# Altium project RFR24 AMS Design V1.PrjPcb (part 1 of 2)
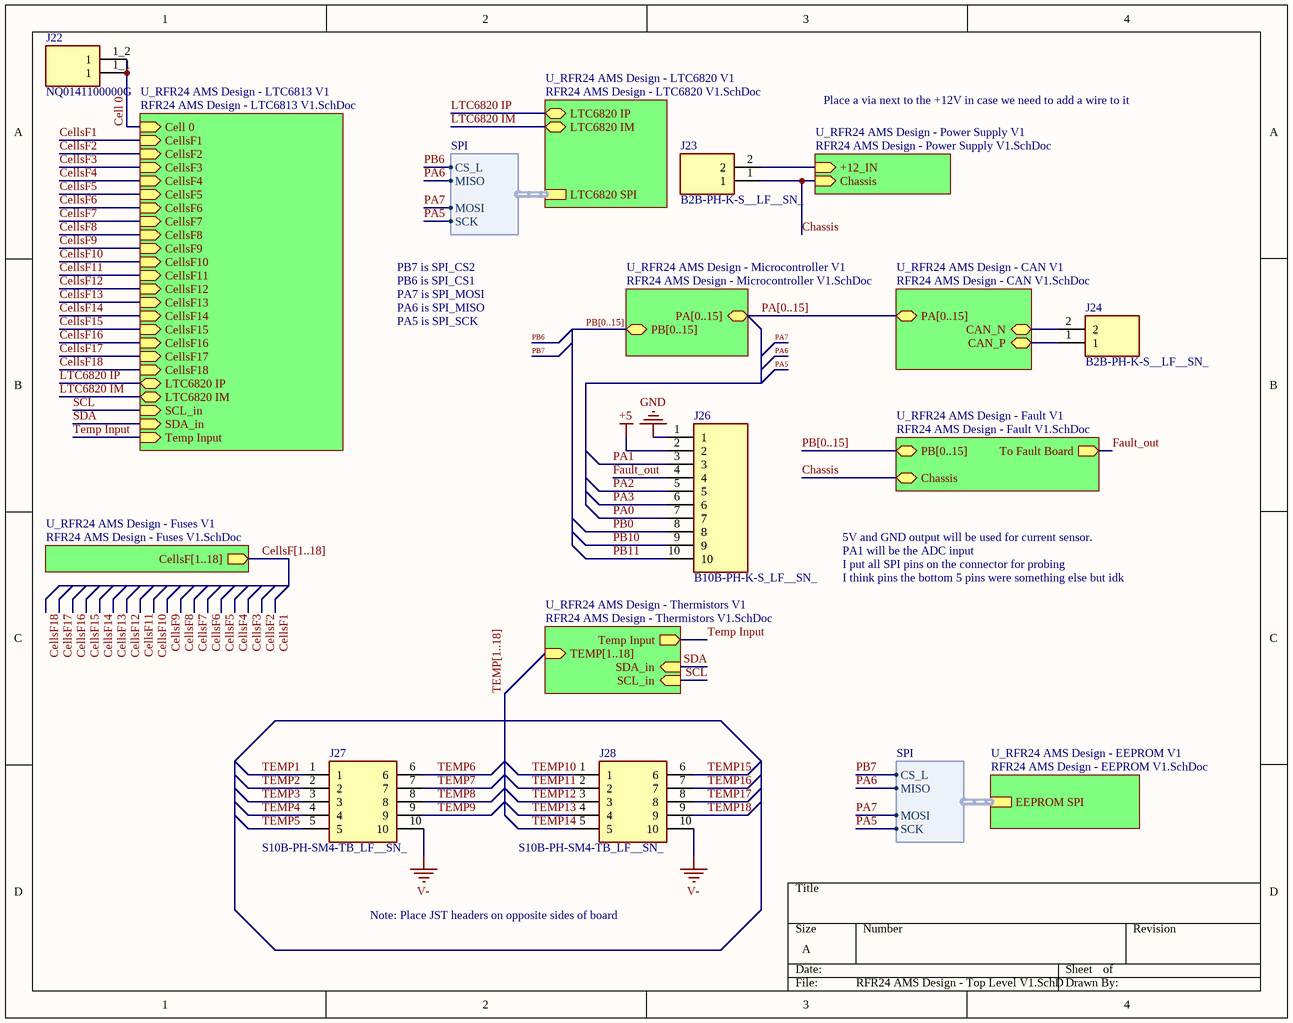
[diagram p0: RFR24 AMS Design - Top Level V1.SchDoc]
10 sheets, 294 parts. Net scope: hierarchical (ports join the sheet entries above them; power ports are global).
Board files: RFR24 AMS Design - PCB V1.PcbDoc, RFR24 AMS Design - PCB V2.PcbDoc, RFR24 AMS Design - MCU Stackup PCB V1.PcbDoc, RFR24 AMS Design - PCB V3.PcbDoc
Sheets:
  RFR24 AMS Design - Top Level V1.SchDoc
    U_RFR24 AMS Design - LTC6813 V1 = RFR24 AMS Design - LTC6813 V1.SchDoc
    U_RFR24 AMS Design - LTC6820 V1 = RFR24 AMS Design - LTC6820 V1.SchDoc
    U_RFR24 AMS Design - Microcontroller V1 = RFR24 AMS Design - Microcontroller V1.SchDoc
    U_RFR24 AMS Design - Power Supply V1 = RFR24 AMS Design - Power Supply V1.SchDoc
    U_RFR24 AMS Design - CAN V1 = RFR24 AMS Design - CAN V1.SchDoc
    U_RFR24 AMS Design - EEPROM V1 = RFR24 AMS Design - EEPROM V1.SchDoc
    U_RFR24 AMS Design - Thermistors V1 = RFR24 AMS Design - Thermistors V1.SchDoc
    U_RFR24 AMS Design - Fuses V1 = RFR24 AMS Design - Fuses V1.SchDoc
    U_RFR24 AMS Design - Fault V1 = RFR24 AMS Design - Fault V1.SchDoc

## Sheet RFR24 AMS Design - Top Level V1.SchDoc
size A; SheetNumber: 1; SheetTotal: 10

### Parts
J22  NQ0141100000G  [AMPHENOL_NQ0141100000G]
J23  B2B-PH-K-S__LF__SN_  [B2BPHKSLFSN]
J24  B2B-PH-K-S__LF__SN_  [B2BPHKSLFSN]
J26  B10B-PH-K-S_LF__SN_  [SHDR10W50P0X200_1X10_2190X450X600P]
J27  S10B-PH-SM4-TB_LF__SN_  [S10B-PH-SM4-TB]
J28  S10B-PH-SM4-TB_LF__SN_  [S10B-PH-SM4-TB]

### Sub-sheets
U_RFR24 AMS Design - CAN V1 = RFR24 AMS Design - CAN V1.SchDoc: PA[0..15] (bidir), CAN_N (bidir), CAN_P (bidir)
U_RFR24 AMS Design - EEPROM V1 = RFR24 AMS Design - EEPROM V1.SchDoc: EEPROM SPI (harness SPI)
U_RFR24 AMS Design - Fault V1 = RFR24 AMS Design - Fault V1.SchDoc: To Fault Board (out), Chassis (bidir), PB[0..15] (bidir)
U_RFR24 AMS Design - Fuses V1 = RFR24 AMS Design - Fuses V1.SchDoc: CellsF[1..18] (out)
U_RFR24 AMS Design - LTC6813 V1 = RFR24 AMS Design - LTC6813 V1.SchDoc: LTC6820 IP (bidir), LTC6820 IM (bidir), SCL_in (in), SDA_in (in), Cell 0 (in), CellsF1 (in), CellsF2 (in), CellsF3 (in), CellsF4 (in), CellsF5 (in), CellsF6 (in), CellsF7 (in), CellsF8 (in), CellsF9 (in), CellsF10 (in), CellsF11 (in), CellsF12 (in), CellsF13 (in), CellsF14 (in), CellsF15 (in), CellsF16 (in), CellsF17 (in), CellsF18 (in), Temp Input (in)
U_RFR24 AMS Design - LTC6820 V1 = RFR24 AMS Design - LTC6820 V1.SchDoc: LTC6820 IP (bidir), LTC6820 IM (bidir), LTC6820 SPI (harness SPI)
U_RFR24 AMS Design - Microcontroller V1 = RFR24 AMS Design - Microcontroller V1.SchDoc: PA[0..15] (bidir), PB[0..15] (bidir)
U_RFR24 AMS Design - Power Supply V1 = RFR24 AMS Design - Power Supply V1.SchDoc: +12_IN (in), Chassis (in)
U_RFR24 AMS Design - Thermistors V1 = RFR24 AMS Design - Thermistors V1.SchDoc: SDA_in (in), SCL_in (in), TEMP[1..18] (in), Temp Input (out)

### Harnesses
SPI: CS_L, MISO, MOSI, SCK

### Nets
+5: J26.2
GND: J26.1
V-: J27.10 J28.10
CAN_N: J24.2 ; sheet U_RFR24 AMS Design - CAN V1/CAN_N
CAN_P: J24.1 ; sheet U_RFR24 AMS Design - CAN V1/CAN_P
Cell 0: J22.1_1(1) J22.1_2(1) ; sheet U_RFR24 AMS Design - LTC6813 V1/Cell 0
Chassis: J23.1 ; sheet U_RFR24 AMS Design - Power Supply V1/Chassis, sheet U_RFR24 AMS Design - Fault V1/Chassis
Fault_out: J26.4 ; sheet U_RFR24 AMS Design - Fault V1/To Fault Board
LTC6820 IM: sheet U_RFR24 AMS Design - LTC6813 V1/LTC6820 IM, sheet U_RFR24 AMS Design - LTC6820 V1/LTC6820 IM
LTC6820 IP: sheet U_RFR24 AMS Design - LTC6813 V1/LTC6820 IP, sheet U_RFR24 AMS Design - LTC6820 V1/LTC6820 IP
PA0: J26.7
PA1: J26.3
PA2: J26.5
PA3: J26.6
PA5: sheet U_RFR24 AMS Design - LTC6820 V1/LTC6820 SPI.SCK, sheet U_RFR24 AMS Design - EEPROM V1/EEPROM SPI.SCK
PA6: sheet U_RFR24 AMS Design - LTC6820 V1/LTC6820 SPI.MISO, sheet U_RFR24 AMS Design - EEPROM V1/EEPROM SPI.MISO  [project net MISO]
PA7: sheet U_RFR24 AMS Design - LTC6820 V1/LTC6820 SPI.MOSI, sheet U_RFR24 AMS Design - EEPROM V1/EEPROM SPI.MOSI  [project net MOSI]
PB0: J26.8
PB10: J26.9
PB11: J26.10
SCL: sheet U_RFR24 AMS Design - LTC6813 V1/SCL_in, sheet U_RFR24 AMS Design - Thermistors V1/SCL_in
SDA: sheet U_RFR24 AMS Design - LTC6813 V1/SDA_in, sheet U_RFR24 AMS Design - Thermistors V1/SDA_in
TEMP1: J27.1
TEMP2: J27.2
TEMP3: J27.3
TEMP4: J27.4
TEMP5: J27.5
TEMP6: J27.6
TEMP7: J27.7
TEMP8: J27.8
TEMP9: J27.9
TEMP10: J28.1
TEMP11: J28.2
TEMP12: J28.3
TEMP13: J28.4
TEMP14: J28.5
TEMP15: J28.6
TEMP16: J28.7
TEMP17: J28.8
TEMP18: J28.9
Temp Input: sheet U_RFR24 AMS Design - LTC6813 V1/Temp Input, sheet U_RFR24 AMS Design - Thermistors V1/Temp Input
NetF19_1: J23.2 ; sheet U_RFR24 AMS Design - Power Supply V1/+12_IN

### Buses and harness runs
bus CellsF[1..18] = sheet U_RFR24 AMS Design - Fuses V1/CellsF[1..18]
bus PA[0..15] = sheet U_RFR24 AMS Design - CAN V1/PA[0..15] = sheet U_RFR24 AMS Design - Microcontroller V1/PA[0..15]
bus PB[0..15] = sheet U_RFR24 AMS Design - Fault V1/PB[0..15]
bus PB[0..15] = sheet U_RFR24 AMS Design - Microcontroller V1/PB[0..15]
bus TEMP[1..18] = sheet U_RFR24 AMS Design - Thermistors V1/TEMP[1..18]

### Notes on the sheet
- Place a via next to the +12V in case we need to add a wire to it
- PA7 is SPI_MOSI
- PB6 is SPI_CS1
- PB7 is SPI_CS2
- PA5 is SPI_SCK
- PA6 is SPI_MISO
- 5V and GND output will be used for current sensor.
- PA1 will be the ADC input
- I put all SPI pins on the connector for probing
- I think pins the bottom 5 pins were something else but idk
- Note: Place JST headers on opposite sides of board

### Library data of the parts
J22 = NQ0141100000G: 1 Position Wire to Board Terminal Block Horizontal with Board Surface Mount; MF: Amphenol Anytek; Package: None; Check_prices: https://www.snapeda.com/parts/NQ0141100000G/Amphenol/view-part/?ref=eda; Availability: In Stock; Value: *; MP: NQ0141100000G; SnapEDA_Link: https://www.snapeda.com/parts/NQ0141100000G/Amphenol/view-part/?ref=snap; Price: None; Purchase-URL: https://pricing.snapeda.com/search/part/NQ0141100000G/?ref=eda
J23 J24 = B2B-PH-K-S__LF__SN_: Circulator or Directional Coupler; Manufacturer_Name: JST (JAPAN SOLDERLESS TERMINALS); Manufacturer_Part_Number: B2B-PH-K-S (LF)(SN); Datasheet Link: http://www.jst-mfg.com/product/pdf/eng/ePH.pdf; Height: 6mm
J26 = B10B-PH-K-S_LF__SN_: Connector; Manufacturer_Name: JST (JAPAN SOLDERLESS TERMINALS); Manufacturer_Part_Number: B10B-PH-K-S(LF)(SN); Datasheet Link: http://uk.rs-online.com/web/p/products/8201428; Height: 6mm; Arrow Part Number: B10B-PH-K-S(LF)(SN); Arrow Price/Stock: https://www.arrow.com/en/products/b10b-ph-k-s-lf-sn/jst-manufacturing?region=europe
J27 J28 = S10B-PH-SM4-TB_LF__SN_: Connector; Manufacturer_Name: JST (JAPAN SOLDERLESS TERMINALS); Manufacturer_Part_Number: S10B-PH-SM4-TB(LF)(SN); Datasheet Link: http://uk.rs-online.com/web/p/products/6881350; Arrow Part Number: S10B-PH-SM4-TB(LF)(SN); Arrow Price/Stock: https://www.arrow.com/en/products/s10b-ph-sm4-tb-lf-sn/jst-manufacturing?region=nac

## Sheet RFR24 AMS Design - LTC6813 V1.SchDoc
size 279 x 457 mm; SheetNumber: 2; SheetTotal: 10
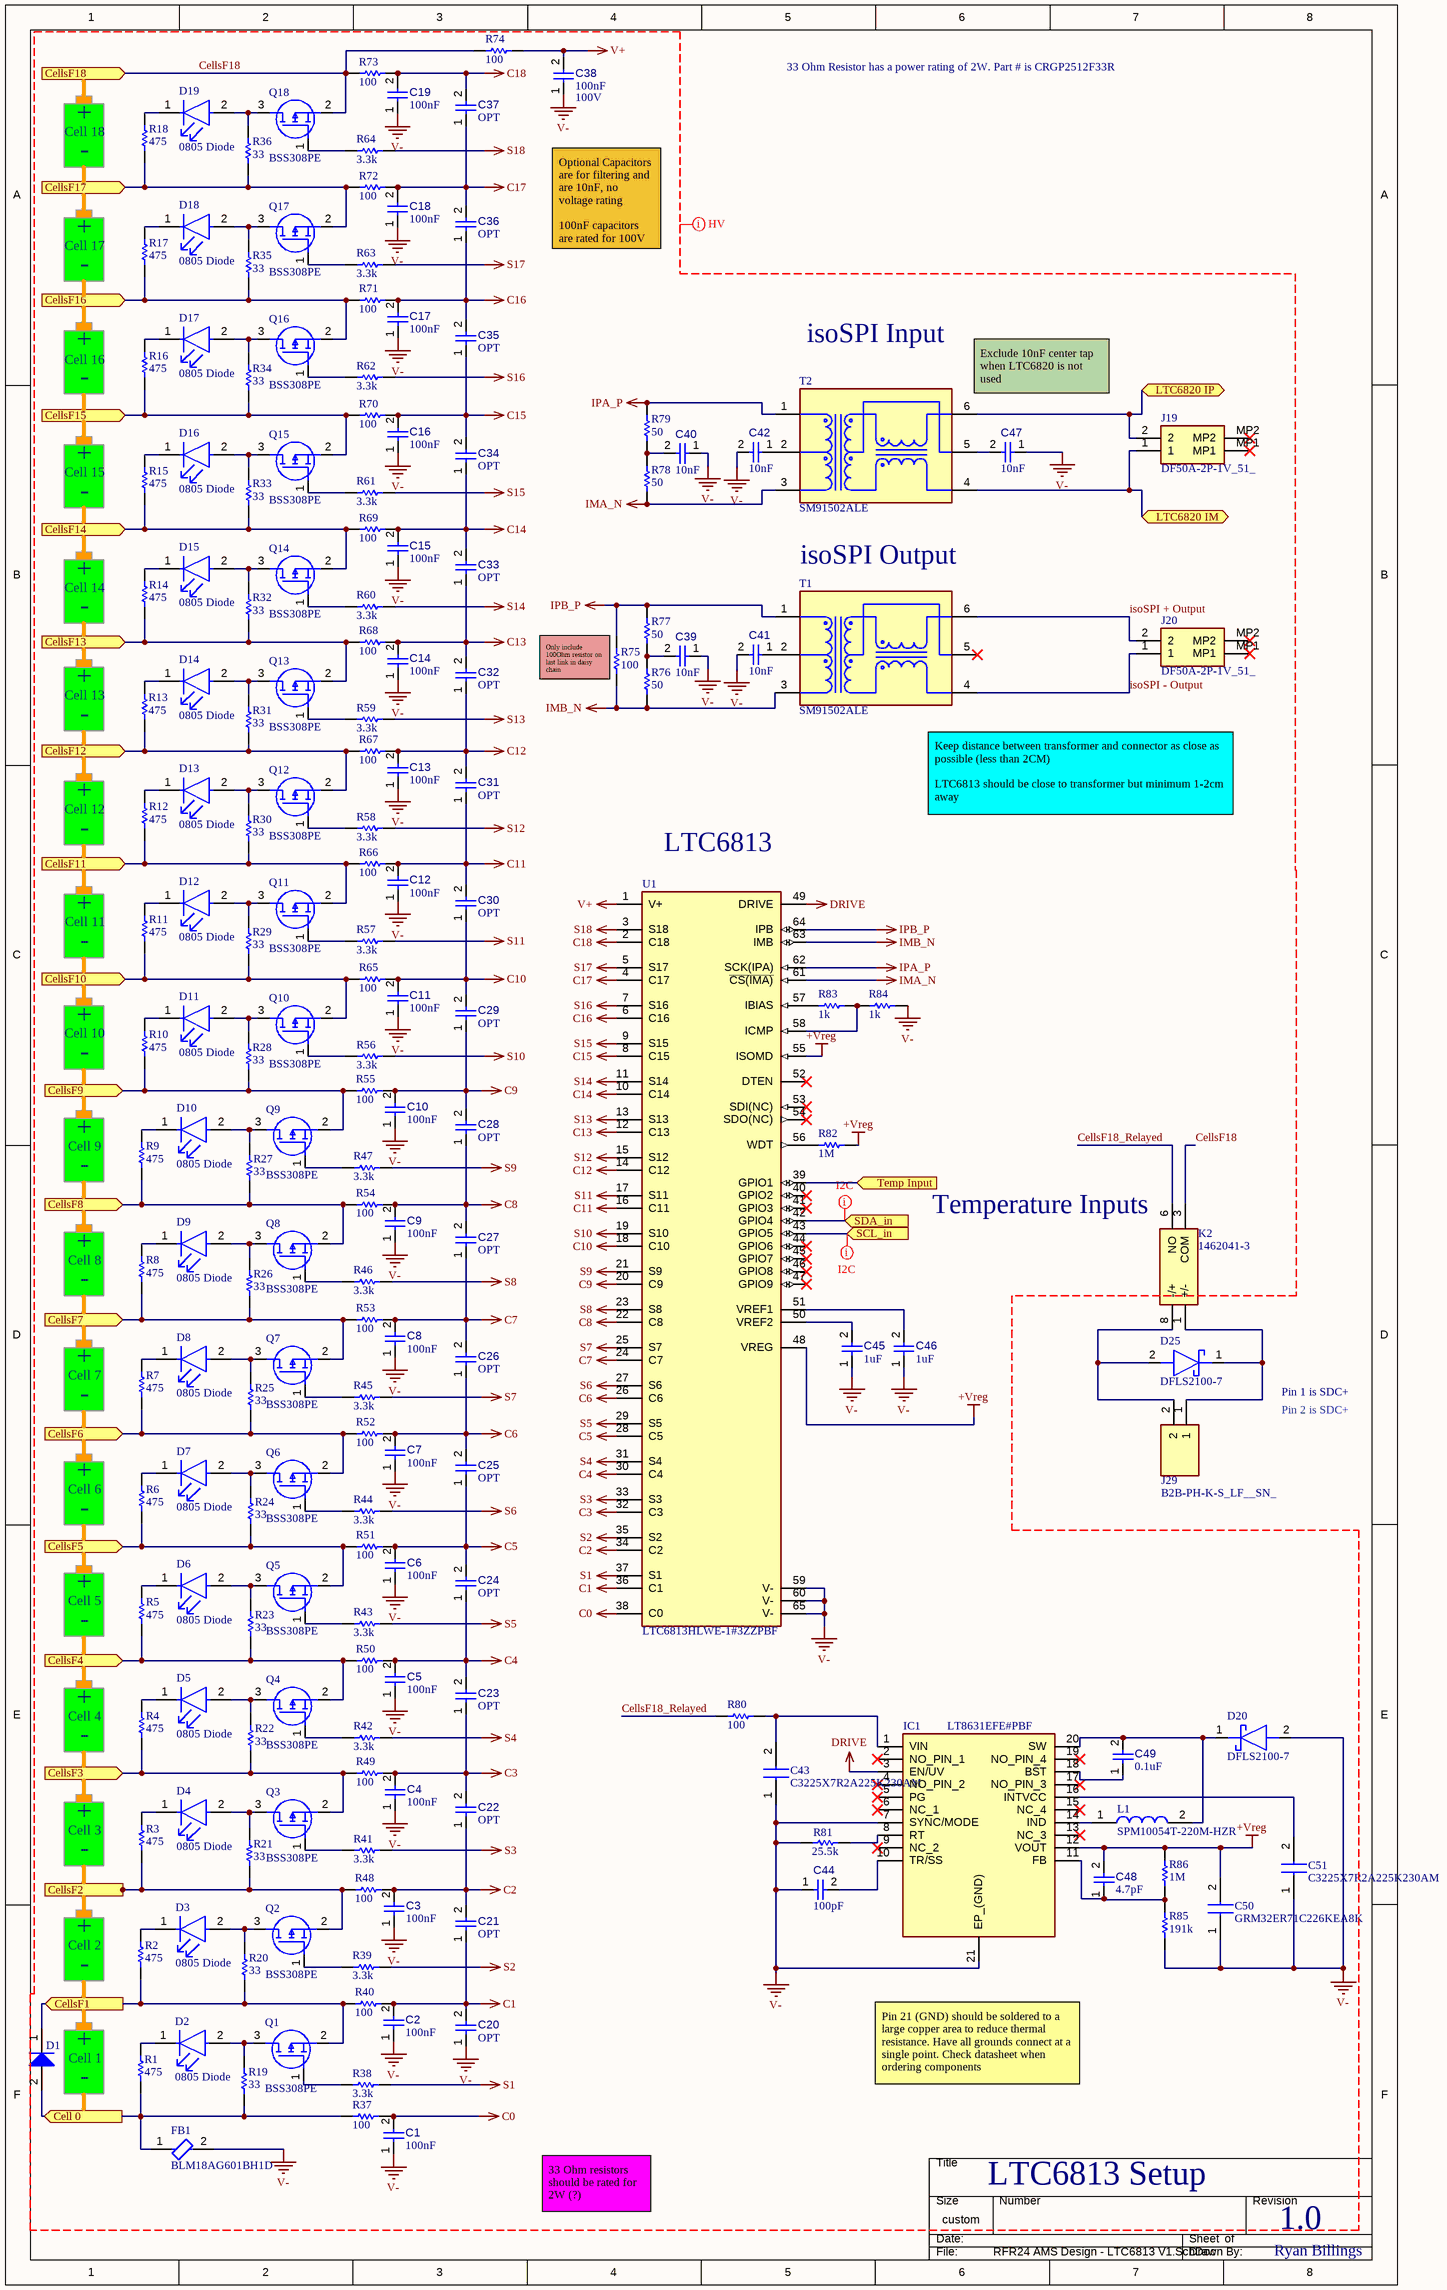
[diagram p1: RFR24 AMS Design - LTC6813 V1.SchDoc]

### Parts
C1  value 100nF  [CAPC2013X145X50ML20T25]  (hidden comment: Capacitor 1 uF +/- 10% 25 V 0805)
C2  value 100nF  [CAPC2013X145X50ML20T25]  (hidden comment: Capacitor 1 uF +/- 10% 25 V 0805)
C3  value 100nF  [CAPC2013X145X50ML20T25]  (hidden comment: Capacitor 1 uF +/- 10% 25 V 0805)
C4  value 100nF  [CAPC2013X145X50ML20T25]  (hidden comment: Capacitor 1 uF +/- 10% 25 V 0805)
C5  value 100nF  [CAPC2013X145X50ML20T25]  (hidden comment: Capacitor 1 uF +/- 10% 25 V 0805)
C6  value 100nF  [CAPC2013X145X50ML20T25]  (hidden comment: Capacitor 1 uF +/- 10% 25 V 0805)
C7  value 100nF  [CAPC2013X145X50ML20T25]  (hidden comment: Capacitor 1 uF +/- 10% 25 V 0805)
C8  value 100nF  [CAPC2013X145X50ML20T25]  (hidden comment: Capacitor 1 uF +/- 10% 25 V 0805)
C9  value 100nF  [CAPC2013X145X50ML20T25]  (hidden comment: Capacitor 1 uF +/- 10% 25 V 0805)
C10  value 100nF  [CAPC2013X145X50ML20T25]  (hidden comment: Capacitor 1 uF +/- 10% 25 V 0805)
C11  value 100nF  [CAPC2013X145X50ML20T25]  (hidden comment: Capacitor 1 uF +/- 10% 25 V 0805)
C12  value 100nF  [CAPC2013X145X50ML20T25]  (hidden comment: Capacitor 1 uF +/- 10% 25 V 0805)
C13  value 100nF  [CAPC2013X145X50ML20T25]  (hidden comment: Capacitor 1 uF +/- 10% 25 V 0805)
C14  value 100nF  [CAPC2013X145X50ML20T25]  (hidden comment: Capacitor 1 uF +/- 10% 25 V 0805)
C15  value 100nF  [CAPC2013X145X50ML20T25]  (hidden comment: Capacitor 1 uF +/- 10% 25 V 0805)
C16  value 100nF  [CAPC2013X145X50ML20T25]  (hidden comment: Capacitor 1 uF +/- 10% 25 V 0805)
C17  value 100nF  [CAPC2013X145X50ML20T25]  (hidden comment: Capacitor 1 uF +/- 10% 25 V 0805)
C18  value 100nF  [CAPC2013X145X50ML20T25]  (hidden comment: Capacitor 1 uF +/- 10% 25 V 0805)
C19  value 100nF  [CAPC2013X145X50ML20T25]  (hidden comment: Capacitor 1 uF +/- 10% 25 V 0805)
C20  value OPT  [CAPC2013X145X50ML20T25]  (hidden comment: Capacitor 1 uF +/- 10% 25 V 0805)
C21  value OPT  [CAPC2013X145X50ML20T25]  (hidden comment: Capacitor 1 uF +/- 10% 25 V 0805)
C22  value OPT  [CAPC2013X145X50ML20T25]  (hidden comment: Capacitor 1 uF +/- 10% 25 V 0805)
C23  value OPT  [CAPC2013X145X50ML20T25]  (hidden comment: Capacitor 1 uF +/- 10% 25 V 0805)
C24  value OPT  [CAPC2013X145X50ML20T25]  (hidden comment: Capacitor 1 uF +/- 10% 25 V 0805)
C25  value OPT  [CAPC2013X145X50ML20T25]  (hidden comment: Capacitor 1 uF +/- 10% 25 V 0805)
C26  value OPT  [CAPC2013X145X50ML20T25]  (hidden comment: Capacitor 1 uF +/- 10% 25 V 0805)
C27  value OPT  [CAPC2013X145X50ML20T25]  (hidden comment: Capacitor 1 uF +/- 10% 25 V 0805)
C28  value OPT  [CAPC2013X145X50ML20T25]  (hidden comment: Capacitor 1 uF +/- 10% 25 V 0805)
C29  value OPT  [CAPC2013X145X50ML20T25]  (hidden comment: Capacitor 1 uF +/- 10% 25 V 0805)
C30  value OPT  [CAPC2013X145X50ML20T25]  (hidden comment: Capacitor 1 uF +/- 10% 25 V 0805)
C31  value OPT  [CAPC2013X145X50ML20T25]  (hidden comment: Capacitor 1 uF +/- 10% 25 V 0805)
C32  value OPT  [CAPC2013X145X50ML20T25]  (hidden comment: Capacitor 1 uF +/- 10% 25 V 0805)
C33  value OPT  [CAPC2013X145X50ML20T25]  (hidden comment: Capacitor 1 uF +/- 10% 25 V 0805)
C34  value OPT  [CAPC2013X145X50ML20T25]  (hidden comment: Capacitor 1 uF +/- 10% 25 V 0805)
C35  value OPT  [CAPC2013X145X50ML20T25]  (hidden comment: Capacitor 1 uF +/- 10% 25 V 0805)
C36  value OPT  [CAPC2013X145X50ML20T25]  (hidden comment: Capacitor 1 uF +/- 10% 25 V 0805)
C37  value OPT  [CAPC2013X145X50ML20T25]  (hidden comment: Capacitor 1 uF +/- 10% 25 V 0805)
C38  value 100nF  Voltage Rating: 100V  [CAPC2013X145X50ML20T25]  (hidden comment: Capacitor 1 uF +/- 10% 25 V 0805)
C39  value 10nF  [CAPC2013X145X50LL20T25]  (hidden comment: Capacitor 1 uF +/- 10% 25 V 0805)
C40  value 10nF  [CAPC2013X145X50LL20T25]  (hidden comment: Capacitor 1 uF +/- 10% 25 V 0805)
C41  value 10nF  [CAPC2013X145X50LL20T25]  (hidden comment: Capacitor 1 uF +/- 10% 25 V 0805)
C42  value 10nF  [CAPC2013X145X50LL20T25]  (hidden comment: Capacitor 1 uF +/- 10% 25 V 0805)
C43  C3225X7R2A225K230AM  [CAPC3225X270N]
C44  value 100pF  [CAPC2013X145X50LL20T25]  (hidden comment: Capacitor 1 uF +/- 10% 25 V 0805)
C45  value 1uF  [CAPC2013X145X50LL20T25]  (hidden comment: Capacitor 1 uF +/- 10% 25 V 0805)
C46  value 1uF  [CAPC2013X145X50LL20T25]  (hidden comment: Capacitor 1 uF +/- 10% 25 V 0805)
C47  value 10nF  [CAPC2013X145X50LL20T25]  (hidden comment: Capacitor 1 uF +/- 10% 25 V 0805)
C48  value 4.7pF  [CAPC2013X145X50LL20T25]  (hidden comment: Capacitor 1 uF +/- 10% 25 V 0805)
C49  value 0.1uF  [CAPC2013X145X50LL20T25]  (hidden comment: Capacitor 1 uF +/- 10% 25 V 0805)
C50  GRM32ER71C226KEA8K  [CAPC3225X270N]
C51  C3225X7R2A225K230AM  [CAPC3225X270N]
D1  unknown  [INF-SOD323_V]  (value not drawn)
D2  0805 Diode  [FP-APHCM2012SYCK-F01-MFG]
D3  0805 Diode  [FP-APHCM2012SYCK-F01-MFG]
D4  0805 Diode  [FP-APHCM2012SYCK-F01-MFG]
D5  0805 Diode  [FP-APHCM2012SYCK-F01-MFG]
D6  0805 Diode  [FP-APHCM2012SYCK-F01-MFG]
D7  0805 Diode  [FP-APHCM2012SYCK-F01-MFG]
D8  0805 Diode  [FP-APHCM2012SYCK-F01-MFG]
D9  0805 Diode  [FP-APHCM2012SYCK-F01-MFG]
D10  0805 Diode  [FP-APHCM2012SYCK-F01-MFG]
D11  0805 Diode  [FP-APHCM2012SYCK-F01-MFG]
D12  0805 Diode  [FP-APHCM2012SYCK-F01-MFG]
D13  0805 Diode  [FP-APHCM2012SYCK-F01-MFG]
D14  0805 Diode  [FP-APHCM2012SYCK-F01-MFG]
D15  0805 Diode  [FP-APHCM2012SYCK-F01-MFG]
D16  0805 Diode  [FP-APHCM2012SYCK-F01-MFG]
D17  0805 Diode  [FP-APHCM2012SYCK-F01-MFG]
D18  0805 Diode  [FP-APHCM2012SYCK-F01-MFG]
D19  0805 Diode  [FP-APHCM2012SYCK-F01-MFG]
D20  DFLS2100-7  [POWERDI123_1]
D25  DFLS2100-7  [POWERDI123_1]
FB1  BLM18AG601BH1D  [FP-BLM18-0_15-t0_8-IPC_A]
IC1  LT8631EFE#PBF  [SOP65P640X120-21N]
J19  DF50A-2P-1V_51_  [DF50A2P1V51]
J20  DF50A-2P-1V_51_  [DF50A2P1V51]
J29  B2B-PH-K-S_LF__SN_  [SHDR2W50P0X200_1X2_590X450X600P]
K2  1462041-3  [14620417]
L1  SPM10054T-220M-HZR  [SPM10054T220MHZR]
Q1  BSS308PE  [SOT95P260X110-3N]
Q2  BSS308PE  [SOT95P260X110-3N]
Q3  BSS308PE  [SOT95P260X110-3N]
Q4  BSS308PE  [SOT95P260X110-3N]
Q5  BSS308PE  [SOT95P260X110-3N]
Q6  BSS308PE  [SOT95P260X110-3N]
Q7  BSS308PE  [SOT95P260X110-3N]
Q8  BSS308PE  [SOT95P260X110-3N]
Q9  BSS308PE  [SOT95P260X110-3N]
Q10  BSS308PE  [SOT95P260X110-3N]
Q11  BSS308PE  [SOT95P260X110-3N]
Q12  BSS308PE  [SOT95P260X110-3N]
Q13  BSS308PE  [SOT95P260X110-3N]
Q14  BSS308PE  [SOT95P260X110-3N]
Q15  BSS308PE  [SOT95P260X110-3N]
Q16  BSS308PE  [SOT95P260X110-3N]
Q17  BSS308PE  [SOT95P260X110-3N]
Q18  BSS308PE  [SOT95P260X110-3N]
R1  value 475  [RESC2013X70X40ML20T20]  (hidden comment: Resistor 1k +/-1% 0805 125 mW)
R2  value 475  [RESC2013X70X40ML20T20]  (hidden comment: Resistor 1k +/-1% 0805 125 mW)
R3  value 475  [RESC2013X70X40ML20T20]  (hidden comment: Resistor 1k +/-1% 0805 125 mW)
R4  value 475  [RESC2013X70X40ML20T20]  (hidden comment: Resistor 1k +/-1% 0805 125 mW)
R5  value 475  [RESC2013X70X40ML20T20]  (hidden comment: Resistor 1k +/-1% 0805 125 mW)
R6  value 475  [RESC2013X70X40ML20T20]  (hidden comment: Resistor 1k +/-1% 0805 125 mW)
R7  value 475  [RESC2013X70X40ML20T20]  (hidden comment: Resistor 1k +/-1% 0805 125 mW)
R8  value 475  [RESC2013X70X40ML20T20]  (hidden comment: Resistor 1k +/-1% 0805 125 mW)
R9  value 475  [RESC2013X70X40ML20T20]  (hidden comment: Resistor 1k +/-1% 0805 125 mW)
R10  value 475  [RESC2013X70X40ML20T20]  (hidden comment: Resistor 1k +/-1% 0805 125 mW)
R11  value 475  [RESC2013X70X40ML20T20]  (hidden comment: Resistor 1k +/-1% 0805 125 mW)
R12  value 475  [RESC2013X70X40ML20T20]  (hidden comment: Resistor 1k +/-1% 0805 125 mW)
R13  value 475  [RESC2013X70X40ML20T20]  (hidden comment: Resistor 1k +/-1% 0805 125 mW)
R14  value 475  [RESC2013X70X40ML20T20]  (hidden comment: Resistor 1k +/-1% 0805 125 mW)
R15  value 475  [RESC2013X70X40ML20T20]  (hidden comment: Resistor 1k +/-1% 0805 125 mW)
R16  value 475  [RESC2013X70X40ML20T20]  (hidden comment: Resistor 1k +/-1% 0805 125 mW)
R17  value 475  [RESC2013X70X40ML20T20]  (hidden comment: Resistor 1k +/-1% 0805 125 mW)
R18  value 475  [RESC2013X70X40ML20T20]  (hidden comment: Resistor 1k +/-1% 0805 125 mW)
R19  33  [RESC2512(6432)_L]
R20  33  [RESC2512(6432)_L]
R21  33  [RESC2512(6432)_L]
R22  33  [RESC2512(6432)_L]
R23  33  [RESC2512(6432)_L]
R24  33  [RESC2512(6432)_L]
R25  33  [RESC2512(6432)_L]
R26  33  [RESC2512(6432)_L]
R27  33  [RESC2512(6432)_L]
R28  33  [RESC2512(6432)_L]
R29  33  [RESC2512(6432)_L]
R30  33  [RESC2512(6432)_L]
R31  33  [RESC2512(6432)_L]
R32  33  [RESC2512(6432)_L]
R33  33  [RESC2512(6432)_L]
R34  33  [RESC2512(6432)_L]
R35  33  [RESC2512(6432)_L]
R36  33  [RESC2512(6432)_L]
R37  value 100  [RESC2013X70X40ML20T20]  (hidden comment: Resistor 1k +/-1% 0805 125 mW)
R38  value 3.3k  [RESC2013X70X40ML20T20]  (hidden comment: Resistor 1k +/-1% 0805 125 mW)
R39  value 3.3k  [RESC2013X70X40ML20T20]  (hidden comment: Resistor 1k +/-1% 0805 125 mW)
R40  value 100  [RESC2013X70X40ML20T20]  (hidden comment: Resistor 1k +/-1% 0805 125 mW)
R41  value 3.3k  [RESC2013X70X40ML20T20]  (hidden comment: Resistor 1k +/-1% 0805 125 mW)
R42  value 3.3k  [RESC2013X70X40ML20T20]  (hidden comment: Resistor 1k +/-1% 0805 125 mW)
R43  value 3.3k  [RESC2013X70X40ML20T20]  (hidden comment: Resistor 1k +/-1% 0805 125 mW)
R44  value 3.3k  [RESC2013X70X40ML20T20]  (hidden comment: Resistor 1k +/-1% 0805 125 mW)
R45  value 3.3k  [RESC2013X70X40ML20T20]  (hidden comment: Resistor 1k +/-1% 0805 125 mW)
R46  value 3.3k  [RESC2013X70X40ML20T20]  (hidden comment: Resistor 1k +/-1% 0805 125 mW)
R47  value 3.3k  [RESC2013X70X40ML20T20]  (hidden comment: Resistor 1k +/-1% 0805 125 mW)
R48  value 100  [RESC2013X70X40ML20T20]  (hidden comment: Resistor 1k +/-1% 0805 125 mW)
R49  value 100  [RESC2013X70X40ML20T20]  (hidden comment: Resistor 1k +/-1% 0805 125 mW)
R50  value 100  [RESC2013X70X40ML20T20]  (hidden comment: Resistor 1k +/-1% 0805 125 mW)
R51  value 100  [RESC2013X70X40ML20T20]  (hidden comment: Resistor 1k +/-1% 0805 125 mW)
R52  value 100  [RESC2013X70X40ML20T20]  (hidden comment: Resistor 1k +/-1% 0805 125 mW)
R53  value 100  [RESC2013X70X40ML20T20]  (hidden comment: Resistor 1k +/-1% 0805 125 mW)
R54  value 100  [RESC2013X70X40ML20T20]  (hidden comment: Resistor 1k +/-1% 0805 125 mW)
R55  value 100  [RESC2013X70X40ML20T20]  (hidden comment: Resistor 1k +/-1% 0805 125 mW)
R56  value 3.3k  [RESC2013X70X40ML20T20]  (hidden comment: Resistor 1k +/-1% 0805 125 mW)
R57  value 3.3k  [RESC2013X70X40ML20T20]  (hidden comment: Resistor 1k +/-1% 0805 125 mW)
R58  value 3.3k  [RESC2013X70X40ML20T20]  (hidden comment: Resistor 1k +/-1% 0805 125 mW)
R59  value 3.3k  [RESC2013X70X40ML20T20]  (hidden comment: Resistor 1k +/-1% 0805 125 mW)
R60  value 3.3k  [RESC2013X70X40ML20T20]  (hidden comment: Resistor 1k +/-1% 0805 125 mW)
R61  value 3.3k  [RESC2013X70X40ML20T20]  (hidden comment: Resistor 1k +/-1% 0805 125 mW)
R62  value 3.3k  [RESC2013X70X40ML20T20]  (hidden comment: Resistor 1k +/-1% 0805 125 mW)
R63  value 3.3k  [RESC2013X70X40ML20T20]  (hidden comment: Resistor 1k +/-1% 0805 125 mW)
R64  value 3.3k  [RESC2013X70X40ML20T20]  (hidden comment: Resistor 1k +/-1% 0805 125 mW)
R65  value 100  [RESC2013X70X40ML20T20]  (hidden comment: Resistor 1k +/-1% 0805 125 mW)
R66  value 100  [RESC2013X70X40ML20T20]  (hidden comment: Resistor 1k +/-1% 0805 125 mW)
R67  value 100  [RESC2013X70X40ML20T20]  (hidden comment: Resistor 1k +/-1% 0805 125 mW)
R68  value 100  [RESC2013X70X40ML20T20]  (hidden comment: Resistor 1k +/-1% 0805 125 mW)
R69  value 100  [RESC2013X70X40ML20T20]  (hidden comment: Resistor 1k +/-1% 0805 125 mW)
R70  value 100  [RESC2013X70X40ML20T20]  (hidden comment: Resistor 1k +/-1% 0805 125 mW)
R71  value 100  [RESC2013X70X40ML20T20]  (hidden comment: Resistor 1k +/-1% 0805 125 mW)
R72  value 100  [RESC2013X70X40ML20T20]  (hidden comment: Resistor 1k +/-1% 0805 125 mW)
R73  value 100  [RESC2013X70X40ML20T20]  (hidden comment: Resistor 1k +/-1% 0805 125 mW)
R74  value 100  [RESC2013X70X40ML20T20]  (hidden comment: Resistor 1k +/-1% 0805 125 mW)
R75  value 100  [RESC2013X70X40LL20T20]  (hidden comment: Resistor 1k +/-1% 0805 125 mW)
R76  value 50  [RESC2013X70X40LL20T20]  (hidden comment: Resistor 1k +/-1% 0805 125 mW)
R77  value 50  [RESC2013X70X40LL20T20]  (hidden comment: Resistor 1k +/-1% 0805 125 mW)
R78  value 50  [RESC2013X70X40LL20T20]  (hidden comment: Resistor 1k +/-1% 0805 125 mW)
R79  value 50  [RESC2013X70X40LL20T20]  (hidden comment: Resistor 1k +/-1% 0805 125 mW)
R80  value 100  [RESC2013X70X40ML20T20]  (hidden comment: Resistor 1k +/-1% 0805 125 mW)
R81  value 25.5k  [RESC2013X70X40LL20T20]  (hidden comment: Resistor 1k +/-1% 0805 125 mW)
R82  value 1M  [RESC2013X70X40LL20T20]  (hidden comment: Resistor 1k +/-1% 0805 125 mW)
R83  value 1k  [RESC2013X70X40LL20T20]  (hidden comment: Resistor 1k +/-1% 0805 125 mW)
R84  value 1k  [RESC2013X70X40LL20T20]  (hidden comment: Resistor 1k +/-1% 0805 125 mW)
R85  value 191k  [RESC2013X70X40LL20T20]  (hidden comment: Resistor 1k +/-1% 0805 125 mW)
R86  value 1M  [RESC2013X70X40LL20T20]  (hidden comment: Resistor 1k +/-1% 0805 125 mW)
T1  SM91502ALE  [FP-SM91502ALE-MFG]
T2  SM91502ALE  [FP-SM91502ALE-MFG]
U1  LTC6813HLWE-1#3ZZPBF  [FP-LWE-64-05-08-1982-MFG]

### Ports
Cell 0 (in), CellsF1 (in), CellsF2 (in), CellsF3 (in), CellsF4 (in), CellsF5 (in), CellsF6 (in), CellsF7 (in), CellsF8 (in), CellsF9 (in), CellsF10 (in), CellsF11 (in), CellsF12 (in), CellsF13 (in), CellsF14 (in), CellsF15 (in), CellsF16 (in), CellsF17 (in), CellsF18 (in), LTC6820 IM (bidir), LTC6820 IP (bidir), SCL_in (in), SDA_in (in), Temp Input (in)

### Nets
+Vreg: C48.2 C50.2 IC1.12(VOUT) R82.2 R86.1 U1.48(VREG) U1.55(ISOMD)
C0: C1.2 R37.2 U1.38(C0)
C1: C2.2 C20.2 C21.1 R40.2 U1.36(C1)
C2: C3.2 C21.2 C22.1 R48.2 U1.34(C2)
C3: C4.2 C22.2 C23.1 R49.2 U1.32(C3)
C4: C5.2 C23.2 C24.1 R50.2 U1.30(C4)
C5: C6.2 C24.2 C25.1 R51.2 U1.28(C5)
C6: C7.2 C25.2 C26.1 R52.2 U1.26(C6)
C7: C8.2 C26.2 C27.1 R53.2 U1.24(C7)
C8: C9.2 C27.2 C28.1 R54.2 U1.22(C8)
C9: C10.2 C28.2 C29.1 R55.2 U1.20(C9)
C10: C11.2 C29.2 C30.1 R65.2 U1.18(C10)
C11: C12.2 C30.2 C31.1 R66.2 U1.16(C11)
C12: C13.2 C31.2 C32.1 R67.2 U1.14(C12)
C13: C14.2 C32.2 C33.1 R68.2 U1.12(C13)
C14: C15.2 C33.2 C34.1 R69.2 U1.10(C14)
C15: C16.2 C34.2 C35.1 R70.2 U1.8(C15)
C16: C17.2 C35.2 C36.1 R71.2 U1.6(C16)
C17: C18.2 C36.2 C37.1 R72.2 U1.4(C17)
C18: C19.2 C37.2 R73.2 U1.2(C18)
DRIVE: IC1.3(EN/UV) U1.49(DRIVE)
IMA_N: R78.1 T2.3 U1.61(~{CS(IMA)})
IMB_N: R75.1 R76.1 T1.3 U1.63(IMB)
IPA_P: R79.2 T2.1 U1.62(SCK(IPA))
IPB_P: R75.2 R77.2 T1.1 U1.64(IPB)
S1: R38.2 U1.37(S1)
S2: R39.2 U1.35(S2)
S3: R41.2 U1.33(S3)
S4: R42.2 U1.31(S4)
S5: R43.2 U1.29(S5)
S6: R44.2 U1.27(S6)
S7: R45.2 U1.25(S7)
S8: R46.2 U1.23(S8)
S9: R47.2 U1.21(S9)
S10: R56.2 U1.19(S10)
S11: R57.2 U1.17(S11)
S12: R58.2 U1.15(S12)
S13: R59.2 U1.13(S13)
S14: R60.2 U1.11(S14)
S15: R61.2 U1.9(S15)
S16: R62.2 U1.7(S16)
S17: R63.2 U1.5(S17)
S18: R64.2 U1.3(S18)
V+: C38.2 R74.2 U1.1(V+)
V-: C1.1 C2.1 C3.1 C4.1 C5.1 C6.1 C7.1 C8.1 C9.1 C10.1 C11.1 C12.1 C13.1 C14.1 C15.1 C16.1 C17.1 C18.1 C19.1 C20.1 C38.1 C39.1 C40.1 C41.2 C42.2 C43.1 C44.1 C45.1 C46.1 C47.1 C50.1 C51.1 D20.2(A) FB1.2 IC1.7(SYNC/MODE) IC1.21(EP_(GND)) R81.2 R84.2 R85.2 U1.59(V-) U1.60(V-) U1.65(V-)
Cell 0: D1.2(A) FB1.1 R1.2 R19.1 R37.1 ; port Cell 0
CellsF1: D1.1(K) Q1.2(S) R2.2 R20.1 R40.1 ; port CellsF1
CellsF2: Q2.2(S) R3.2 R21.1 R48.1 ; port CellsF2
CellsF3: Q3.2(S) R4.2 R22.1 R49.1 ; port CellsF3
CellsF4: Q4.2(S) R5.2 R23.1 R50.1 ; port CellsF4
CellsF5: Q5.2(S) R6.2 R24.1 R51.1 ; port CellsF5
CellsF6: Q6.2(S) R7.2 R25.1 R52.1 ; port CellsF6
CellsF7: Q7.2(S) R8.2 R26.1 R53.1 ; port CellsF7
CellsF8: Q8.2(S) R9.2 R27.1 R54.1 ; port CellsF8
CellsF9: Q9.2(S) R10.2 R28.1 R55.1 ; port CellsF9
CellsF10: Q10.2(S) R11.2 R29.1 R65.1 ; port CellsF10
CellsF11: Q11.2(S) R12.2 R30.1 R66.1 ; port CellsF11
CellsF12: Q12.2(S) R13.2 R31.1 R67.1 ; port CellsF12
CellsF13: Q13.2(S) R14.2 R32.1 R68.1 ; port CellsF13
CellsF14: Q14.2(S) R15.2 R33.1 R69.1 ; port CellsF14
CellsF15: Q15.2(S) R16.2 R34.1 R70.1 ; port CellsF15
CellsF16: Q16.2(S) R17.2 R35.1 R71.1 ; port CellsF16
CellsF17: Q17.2(S) R18.2 R36.1 R72.1 ; port CellsF17
CellsF18: K2.3(COM) Q18.2(S) R73.1 R74.1 ; port CellsF18
CellsF18_Relayed: K2.6(NO) R80.2
isoSPI + Output: J20.2 T1.6
isoSPI - Output: J20.1 T1.4
LTC6820 IM: J19.1 T2.4 ; port LTC6820 IM
LTC6820 IP: J19.2 T2.6 ; port LTC6820 IP
SCL: U1.43(GPIO5) ; port SCL_in
SDA: U1.42(GPIO4) ; port SDA_in
Temp Input: U1.39(GPIO1) ; port Temp Input
NetC39_2: C39.2 R76.2 R77.1
NetC40_2: C40.2 R78.2 R79.1
NetC41_1: C41.1 T1.2
NetC42_1: C42.1 T2.2
NetC43_2: C43.2 IC1.1(VIN) R80.1
NetC44_2: C44.2 IC1.10(TR/SS)
NetC45_2: C45.2 U1.50(VREF2)
NetC46_2: C46.2 U1.51(VREF1)
NetC47_2: C47.2 T2.5
NetC48_1: C48.1 IC1.11(FB) R85.1 R86.2
NetC49_1: C49.1 IC1.18(BST)
NetC49_2: C49.2 D20.1(K) IC1.20(SW) L1.2
NetC51_2: C51.2 IC1.16(INTVCC)
NetD2_1: D2.1(C) R1.1
NetD2_2: D2.2(A) Q1.3(D) R19.2
NetD3_1: D3.1(C) R2.1
NetD3_2: D3.2(A) Q2.3(D) R20.2
NetD4_1: D4.1(C) R3.1
NetD4_2: D4.2(A) Q3.3(D) R21.2
NetD5_1: D5.1(C) R4.1
NetD5_2: D5.2(A) Q4.3(D) R22.2
NetD6_1: D6.1(C) R5.1
NetD6_2: D6.2(A) Q5.3(D) R23.2
NetD7_1: D7.1(C) R6.1
NetD7_2: D7.2(A) Q6.3(D) R24.2
NetD8_1: D8.1(C) R7.1
NetD8_2: D8.2(A) Q7.3(D) R25.2
NetD9_1: D9.1(C) R8.1
NetD9_2: D9.2(A) Q8.3(D) R26.2
NetD10_1: D10.1(C) R9.1
NetD10_2: D10.2(A) Q9.3(D) R27.2
NetD11_1: D11.1(C) R10.1
NetD11_2: D11.2(A) Q10.3(D) R28.2
NetD12_1: D12.1(C) R11.1
NetD12_2: D12.2(A) Q11.3(D) R29.2
NetD13_1: D13.1(C) R12.1
NetD13_2: D13.2(A) Q12.3(D) R30.2
NetD14_1: D14.1(C) R13.1
NetD14_2: D14.2(A) Q13.3(D) R31.2
NetD15_1: D15.1(C) R14.1
NetD15_2: D15.2(A) Q14.3(D) R32.2
NetD16_1: D16.1(C) R15.1
NetD16_2: D16.2(A) Q15.3(D) R33.2
NetD17_1: D17.1(C) R16.1
NetD17_2: D17.2(A) Q16.3(D) R34.2
NetD18_1: D18.1(C) R17.1
NetD18_2: D18.2(A) Q17.3(D) R35.2
NetD19_1: D19.1(C) R18.1
NetD19_2: D19.2(A) Q18.3(D) R36.2
NetD25_1: D25.1(K) J29.1 K2.1(+/-)
NetD25_2: D25.2(A) J29.2 K2.8(-/+)
NetIC1_8: IC1.8(RT) R81.1
NetIC1_14: IC1.14(IND) L1.1
NetQ1_1: Q1.1(G) R38.1
NetQ2_1: Q2.1(G) R39.1
NetQ3_1: Q3.1(G) R41.1
NetQ4_1: Q4.1(G) R42.1
NetQ5_1: Q5.1(G) R43.1
NetQ6_1: Q6.1(G) R44.1
NetQ7_1: Q7.1(G) R45.1
NetQ8_1: Q8.1(G) R46.1
NetQ9_1: Q9.1(G) R47.1
NetQ10_1: Q10.1(G) R56.1
NetQ11_1: Q11.1(G) R57.1
NetQ12_1: Q12.1(G) R58.1
NetQ13_1: Q13.1(G) R59.1
NetQ14_1: Q14.1(G) R60.1
NetQ15_1: Q15.1(G) R61.1
NetQ16_1: Q16.1(G) R62.1
NetQ17_1: Q17.1(G) R63.1
NetQ18_1: Q18.1(G) R64.1
NetR82_1: R82.1 U1.56(WDT)
NetR83_1: R83.1 U1.57(IBIAS)
NetR83_2: R83.2 R84.1 U1.58(ICMP)

Not connected (* = marked no-connect by the designer): IC1 2(NO_PIN_1)* 4(NO_PIN_2)* 5(PG)* 6(NC_1)* 9(NC_2)* 13(NC_3)* 15(NC_4)* 17(NO_PIN_3)* 19(NO_PIN_4)*; J19 MP1* MP2*; J20 MP1* MP2*; T1 5*; U1 40(GPIO2)* 41(GPIO3)* 44(GPIO6)* 45(GPIO7)* 46(GPIO8)* 47(GPIO9)* 52(DTEN)* 53(SDI(NC))* 54(SDO(NC))*

### Layout directives
net class HV: +Vreg, C0, C1, C2, C3, C4, C5, C6, C7, C8, C9, C10, C11, C12, C13, C14, C15, C16, C17, C18, CellsF18, CellsF18_Relayed, DRIVE, IMA_N, IMB_N, IPA_P, IPB_P, isoSPI + Output, isoSPI - Output, S1, S2, S3, S4, S5, S6, S7, S8, S9, S10, S11, S12, S13, S14, S15, S16, S17, S18, V+, V-
rule Matched Net Lengths [Tolerance = 1000mil]; net class I2C: SCL, SDA

### Notes on the sheet
- 33 Ohm Resistor has a power rating of 2W. Part # is CRGP2512F33R
- (near R18) Cell 18
- +
- -
- (near R17) Cell 17
- Optional Capacitors are for filtering and are 10nF, no voltage rating
  100nF capacitors are rated for 100V
- isoSPI Input
- (near R16) Cell 16
- (near T2) Exclude 10nF center tap when LTC6820 is not used
- (near R15) Cell 15
- (near R14) Cell 14
- isoSPI Output
- (near R13) Cell 13
- (near R75) Only include 100Ohm resistor on last link in daisy chain
- (near R12) Cell 12
- (near U1) LTC6813
- (near T1) Keep distance between transformer and connector as close as possible (less than 2CM)
  LTC6813 should be close to transformer but minimum 1-2cm away
- (near R11) Cell 11
- (near R10) Cell 10
- (near R9) Cell 9
- (near R9) -
- (near K2) Temperature Inputs
- (near R8) Cell 8
- (near R8) -
- (near R7) Cell 7
- (near R7) -
- Pin 1 is SDC+
- Pin 2 is SDC+
- (near R6) Cell 6
- (near R6) -
- (near R5) Cell 5
- (near R5) -
- (near R4) Cell 4
- (near R4) -
- (near R3) Cell 3
- (near R3) -
- (near R2) Cell 2
- (near R2) -
- Cell 1
- Pin 21 (GND) should be soldered to a large copper area to reduce thermal resistance. Have all grounds connect at a single point. Check datasheet when ordering components
- 33 Ohm resistors should be rated for 2W (?)
- LTC6813 Setup
- 1.0
- Ryan Billings

### Library data of the parts
C1-C19 C39-C42 C44-C49 = CMP-001-00010-6: Chip Capacitor, 1 uF, +/-10%, 25 V, 0805 (2012 Metric); Capacitor Type: Ceramic; Voltage Rating: 25V; RoHS Compliant: True; Pins: 2; Mounting Technology: SM; Max Operating Temperature: 125°C; Min Operating Temperature: -55°C; Tolerance: 10%; Case/Package: 0805
C20-C37 = CMP-001-00010-6: Chip Capacitor, 1 uF, +/-10%, 25 V, 0805 (2012 Metric); Capacitor Type: Ceramic; Voltage Rating: 100V; RoHS Compliant: True; Pins: 2; Mounting Technology: SM; Max Operating Temperature: 125°C; Min Operating Temperature: -55°C; Tolerance: 10%; Case/Package: 0805
C38 = CMP-001-00010-6: Chip Capacitor, 1 uF, +/-10%, 25 V, 0805 (2012 Metric); Capacitor Type: Ceramic; RoHS Compliant: True; Pins: 2; Mounting Technology: SM; Max Operating Temperature: 125°C; Min Operating Temperature: -55°C; Tolerance: 10%; Case/Package: 0805
C43 C51 = C3225X7R2A225K230AM: Capacitor; Manufacturer_Name: TDK; Datasheet Link: https://product.tdk.com/info/en/catalog/datasheets/mlcc_commercial_midvoltage_en.pdf; Manufacturer_Part_Number: C3225X7R2A225K230AM; Mouser Part Number: 810-C3225X7R2A225KT5; Mouser Price/Stock: https://www.mouser.co.uk/ProductDetail/TDK/C3225X7R2A225K230AM?qs=LcTL%2F5vFEzFqvsZK9aVShQ%3D%3D; Arrow Part Number: C3225X7R2A225K230AM; Arrow Price/Stock: https://www.arrow.com/en/products/c3225x7r2a225k230am/tdk?region=nac
C50 = GRM32ER71C226KEA8K: Capacitor; Manufacturer_Name: Murata Electronics; Datasheet Link: http://psearch.en.murata.com/capacitor/product/GRM32ER71E226KE15%23.pdf; Height: 2.7mm; Manufacturer_Part_Number: GRM32ER71C226KEA8K; Mouser Part Number: 81-GRM32ER71C226KEA8; Mouser Price/Stock: https://www.mouser.co.uk/ProductDetail/Murata-Electronics/GRM32ER71C226KEA8K?qs=RcG8xmE7yp20rpOqweGpcQ%3D%3D
D1 = CMP-1182-00005-1: Silicon Schottky Diode, -55 to 125 degC, SOD323, Reel, Green; PartNumber: BAS170W; Manufacturer: Infineon; Green: TRUE; VF (max): 1,000Â mV; VR (max): 70Â V; Configuration: Single; CT (max): 2Â pF; IF (max): 70Â mA; PackageReference: SOD323; ComponentLink3URL: http://www.infineon.com/dgdl/SOD323-Package_Overview.pdf?folderId=db3a30431936bc4b011952aab84f3bbe&fileId=db3a30431936bc4b011952beed653be3; PackageDescription: 2-Pin Small Outline Diode Package, 1.25 x 1.7 mm Body; ComponentLink2URL: http://www.infineon.com/dgdl/bas70_bas170series.pdf?folderId=db3a30431400ef68011425f1ca2505e3&fileId=db3a304314dca389011518ad41680e12; ComponentLink3Description: Package Specification; ComponentLink1URL: http://www.infineon.com/; ComponentLink1Description: Manufacturer URL; Packing: Reel; ComponentLink2Description: Datasheet; Mounting Technology: Surface Mount
D2-D19 = CMP-44529-000064-1: LED YELLOW CLEAR CHIP SMD; Number of LEDs: 1; Luminous Intensity: 150mcd; Dominant Wavelength: 590nm; Test Current: 20mA; Illumination Color: Green; Forward Voltage: 2V; Viewing Angle: 110°; Number of Pins: 2; Packaging: Tape and Reel; Width: 1.25mm; Height: 0.4mm; Lens Color: Clear; RoHS Compliant: Yes; Lead Free: Lead Free; Min Operating Temperature: -40°C; Case Code (Imperial): 0805; Case/Package: 0805; Series: APHCM; Wavelength: 590nm; Max Operating Temperature: 85°C; Length: 2mm; Color: Yellow; Package Quantity: 2000; Mount: Surface Mount; Lens Style: Clear; Forward Current: 20mA; Case Code (Metric): 2012
D20 = DFLS2100-7: Schottky Diode; Manufacturer_Name: Diodes Inc.; Datasheet Link: https://www.diodes.com/assets/Datasheets/ds31475.pdf; Manufacturer_Part_Number: DFLS2100-7; Mouser Part Number: 621-DFLS2100-7; Mouser Price/Stock: https://www.mouser.co.uk/ProductDetail/Diodes-Incorporated/DFLS2100-7?qs=oUsD4qhOtFwaYm85ClLOtA%3D%3D; Arrow Part Number: DFLS2100-7; Arrow Price/Stock: https://www.arrow.com/en/products/dfls2100-7/diodes-incorporated?region=asia
D25 = DFLS2100-7: Schottky Diode; Manufacturer_Name: Diodes Incorporated; Datasheet Link: https://www.diodes.com/assets/Datasheets/ds31475.pdf; Manufacturer_Part_Number: DFLS2100-7; Mouser Part Number: 621-DFLS2100-7; Mouser Price/Stock: https://www.mouser.co.uk/ProductDetail/Diodes-Incorporated/DFLS2100-7?qs=oUsD4qhOtFwaYm85ClLOtA%3D%3D; Arrow Part Number: DFLS2100-7; Arrow Price/Stock: https://www.arrow.com/en/products/dfls2100-7/diodes-incorporated?region=nac
FB1 = CMP-06046-002494-1: Chip Ferrite Bead, 0603, 600Ω @ 100MHz, 0.38Ω, 25%, 500mA; DC Resistance (DCR): 380mR; Number of Lines: 1; Ratings: AEC-Q200; Case Code (Imperial): 0603; Max Operating Temperature: 150°C; Case Code (Metric): 1608; RoHS Compliant: Yes; Min Operating Temperature: -55°C; Max Current Rating: 500mA; Case/Package: 0603
IC1 = LT8631EFE#PBF: Integrated Circuit; Manufacturer_Name: Analog Devices; Datasheet Link: http://www.analog.com/media/en/technical-documentation/data-sheets/8631fb.pdf; Height: 1.2mm; Manufacturer_Part_Number: LT8631EFE#PBF; Mouser Part Number: 584-LT8631EFE#PBF; Mouser Price/Stock: https://www.mouser.co.uk/ProductDetail/Analog-Devices/LT8631EFEPBF?qs=oahfZPh6IAJREdiCXC9Tqg%3D%3D; Arrow Part Number: LT8631EFE#PBF; Arrow Price/Stock: https://www.arrow.com/en/products/lt8631efepbf/analog-devices?region=nac
J19 J20 = DF50A-2P-1V_51_: Connector; Manufacturer_Name: Hirose; Manufacturer_Part_Number: DF50A-2P-1V(51); Datasheet Link: https://www.hirose.com/en/product/document?clcode=CL0665-1001-3-51&productname=DF50A-2P-1V%2851%29&series=DF50A&documenttype=2DDrawing&lang=en&documentid=0000947500; Height: 7.2mm; Mouser Part Number: 798-DF50A-2P-1V(51); Mouser Price/Stock: https://www.mouser.co.uk/ProductDetail/Hirose-Connector/DF50A-2P-1V51?qs=%2FPhP5b5hXcqdQOMDxlJGQQ%3D%3D
J29 = B2B-PH-K-S_LF__SN_: Connector; Manufacturer_Name: JST (JAPAN SOLDERLESS TERMINALS); Manufacturer_Part_Number: B2B-PH-K-S(LF)(SN); Datasheet Link: https://datasheet.lcsc.com/szlcsc/JST-Sales-America-B2B-PH-K-S-LF-SN_C131337.pdf; Height: 6mm; Arrow Part Number: B2B-PH-K-S(LF)(SN); Arrow Price/Stock: https://www.arrow.com/en/products/b2b-ph-k-s-lf-sn/jst-manufacturing?region=europe
K2 = 1462041-3: Relay or Contactor; Manufacturer_Name: TE Connectivity; Datasheet Link: https://www.te.com/commerce/DocumentDelivery/DDEController?Action=srchrtrv&DocNm=108-98024&DocType=Data+Sheet&DocLang=English&PartCntxt=1462041-3&DocFormat=pdf; Height: 4mm; Manufacturer_Part_Number: 1462041-3; Arrow Part Number: 1462041-3; Arrow Price/Stock: https://www.arrow.com/en/products/1462041-3/te-connectivity
L1 = SPM10054T-220M-HZR: Inductor; Manufacturer_Name: TDK; Datasheet Link: https://product.tdk.com/system/files/dam/doc/product/inductor/inductor/smd/catalog/inductor_automotive_power_spm10054-hzr_en.pdf; Height: 5.4mm; Manufacturer_Part_Number: SPM10054T-220M-HZR; Mouser Part Number: 810-SPM10054220MHZR; Mouser Price/Stock: https://www.mouser.co.uk/ProductDetail/TDK/SPM10054T-220M-HZR?qs=amGC7iS6iy%2FkUVmIwPG8Sg%3D%3D
Q1-Q18 = BSS308PE: MOSFET (P-Channel); Manufacturer_Name: Infineon; Datasheet Link: http://www.infineon.com/dgdl/Infineon-BSS308PE-DS-v02_03-en.pdf?fileId=db3a304330f686060131099c80400073; Height: 1.1mm; Manufacturer_Part_Number: BSS308PE
R1-R18 R37-R86 = CMP-009-00010-5: Chip Resistor, 1 KOhm, +/- 1%, 0.125 W, -55 to 155 degC, 0805 (2013 Metric); Power: 125mW; Voltage Rating: 150V; Tolerance: 1%; RoHS Compliant: True; Mounting Technology: SM; Pins: 2; Case/Package: 0805; Max Operating Temperature: 155°C; Min Operating Temperature: -55°C
R19-R36 = CMP-1018-00001-1: Jumper 2512 (6432 Metric); Tolerance: None; Case-EIA: 2512; Value: 0.00 Ohm; Case-Metric: 6432; Technology: SMT; Power: None
T1 T2 = CMP-07264-000001-1: BMS XFORMER 1-CH 1000V AECQ +125; Manufacturer: Bourns; Standoff Height: 0.13mm; Turns Ratio: 1:1; Automotive Grade: Grade 1; Isolation Voltage: 4300VDC; Return Loss: -22dB; Insertion Loss: -0.25dB; Height: 5.72mm; Automotive: Yes; Package: 0; Device Class L3: unset; ComponentLink2Description: Datasheet; Category: Trans; ComponentLink2URL: https://www.bourns.com/docs/product-datasheets/SM91502AL.pdf; Device Class L1: Passive Components; Manufacturer Part Number: SM91502ALE; Temperature Range High: +125°C; Digikey Description: BMS XFORMER 1-CH 1000V AECQ +125; RoHS: TRUE; Lead Free: Yes; Octopart: https://octopart.com/sm91502ale-bourns-95732123; Device Class L2: Transformers; Temperature: -40°C to +125°C; Temperature Range Low: -40°C
U1 = CMP-09132-000002-1: 18 CHANNEL MULTICELL BATTERY STA; Manufacturer: Analog Devices; Number Of Outputs: 1; Min Supply Voltage: 2.7V; Max Junction Temp: +125°C; Number Of Cells: 18; Output Voltage: 5.7V; Standoff Height: 0.05mm; Nominal Supply Current: 3-6.1uA; Automotive Grade: Grade 1; Max Supply Voltage: 3.6V; Temperature: -40°C to +125°C; Temperature Range Low: -40°C; Lead Free: Yes; Device Class L1: Integrated Circuits (ICs); ComponentLink2Description: Datasheet; ComponentLink2URL: https://www.analog.com/media/en/technical-documentation/data-sheets/LTC6813-1.pdf; Height: 1.6mm; Package: LWE-64-05-08-1982; Digikey Description: 18 CHANNEL MULTICELL BATTERY STA; RoHS: TRUE; Category: IC; Octopart: https://octopart.com/ltc6813hlwe-1%233zzpbf-analog+devices-90390400; Temperature Range High: +125°C; Automotive: Yes; Manufacturer Part Number: LTC6813HLWE-1#3ZZPBF; Device Class L3: Battery Management; Device Class L2: Power Management ICs; Ipc Land Pattern Name: QFP50P1200X1200X160-64

## Sheet RFR24 AMS Design - LTC6820 V1.SchDoc
size A; SheetNumber: 3; SheetTotal: 10
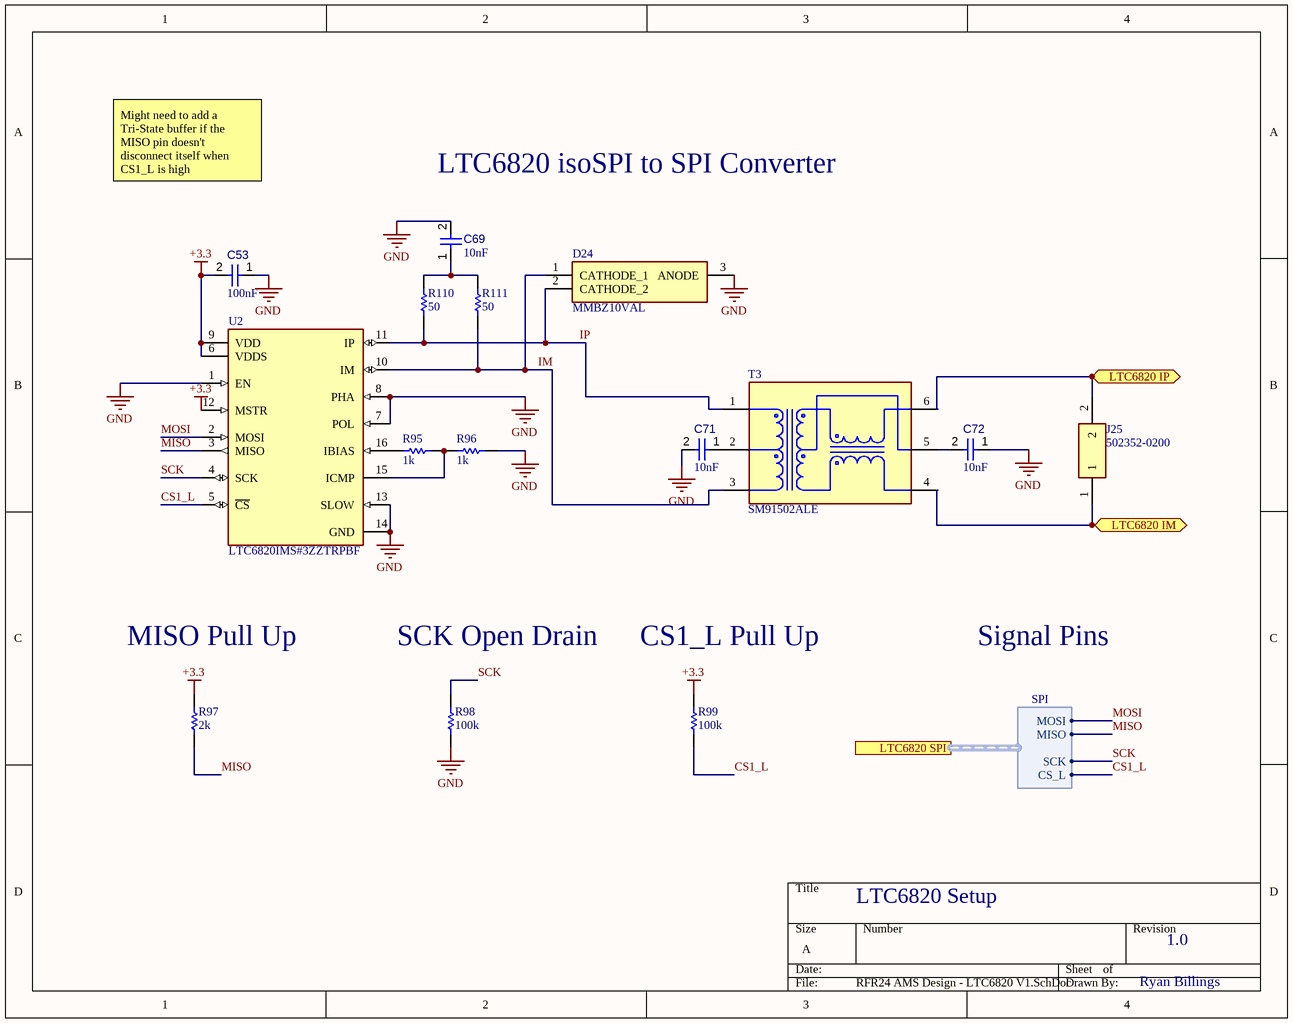
[diagram p2: RFR24 AMS Design - LTC6820 V1.SchDoc]

### Parts
C53  value 100nF  [CAPC2013X145X50LL20T25]  (hidden comment: Capacitor 1 uF +/- 10% 25 V 0805)
C69  value 10nF  [CAPC2013X145X50LL20T25]  (hidden comment: Capacitor 1 uF +/- 10% 25 V 0805)
C71  value 10nF  [CAPC2013X145X50LL20T25]  (hidden comment: Capacitor 1 uF +/- 10% 25 V 0805)
C72  value 10nF  [CAPC2013X145X50LL20T25]  (hidden comment: Capacitor 1 uF +/- 10% 25 V 0805)
D24  MMBZ10VAL  [SOT95P230X110-3N]
J25  502352-0200  [5023520200]
R95  value 1k  [RESC2013X70X40LL20T20]  (hidden comment: Resistor 1k +/-1% 0805 125 mW)
R96  value 1k  [RESC2013X70X40LL20T20]  (hidden comment: Resistor 1k +/-1% 0805 125 mW)
R97  value 2k  [RESC2013X70X40LL20T20]  (hidden comment: Resistor 1k +/-1% 0805 125 mW)
R98  value 100k  [RESC2013X70X40LL20T20]  (hidden comment: Resistor 1k +/-1% 0805 125 mW)
R99  value 100k  [RESC2013X70X40LL20T20]  (hidden comment: Resistor 1k +/-1% 0805 125 mW)
R110  value 50  [RESC2013X70X40LL20T20]  (hidden comment: Resistor 1k +/-1% 0805 125 mW)
R111  value 50  [RESC2013X70X40LL20T20]  (hidden comment: Resistor 1k +/-1% 0805 125 mW)
T3  SM91502ALE  [FP-SM91502ALE-MFG]
U2  LTC6820IMS#3ZZTRPBF  [FP-MS-16-05-08-1669-IPC_C]

### Ports
LTC6820 IM (bidir), LTC6820 IP (bidir), LTC6820 SPI (harness SPI)

### Harnesses
SPI: MOSI, MISO, SCK, CS_L

### Nets
+3.3: C53.2 R97.2 R99.2 U2.6(VDDS) U2.9(VDD) U2.12(MSTR)
GND: C53.1 C69.2 C71.2 C72.1 D24.3(ANODE) R96.2 R98.1 U2.1(EN) U2.7(POL) U2.8(PHA) U2.13(SLOW) U2.14(GND)
CS1_L: R99.1 U2.5(~{CS}) ; port LTC6820 SPI.CS_L
IM: D24.1(CATHODE_1) R111.1 T3.3 U2.10(IM)
IP: D24.2(CATHODE_2) R110.1 T3.1 U2.11(IP)
LTC6820 IM: J25.1 T3.4 ; port LTC6820 IM
LTC6820 IP: J25.2 T3.6 ; port LTC6820 IP
MISO: R97.1 U2.3(MISO) ; port LTC6820 SPI.MISO
MOSI: U2.2(MOSI) ; port LTC6820 SPI.MOSI
SCK: R98.2 U2.4(SCK) ; port LTC6820 SPI.SCK  [project net PA5]
NetC69_1: C69.1 R110.2 R111.2
NetC71_1: C71.1 T3.2
NetC72_2: C72.2 T3.5
NetR95_1: R95.1 U2.16(IBIAS)
NetR95_2: R95.2 R96.1 U2.15(ICMP)

### Notes on the sheet
- Might need to add a Tri-State buffer if the MISO pin doesn't disconnect itself when CS1_L is high
- LTC6820 isoSPI to SPI Converter
- MISO Pull Up
- SCK Open Drain
- CS1_L Pull Up
- Signal Pins
- LTC6820 Setup
- 1.0
- Ryan Billings

### Library data of the parts
C53 C69 C71 C72 = CMP-001-00010-6: as C1 on sheet RFR24 AMS Design - LTC6813 V1; RoHS Compliant: True; Pins: 2; Mounting Technology: SM; Max Operating Temperature: 125°C; Min Operating Temperature: -55°C; Tolerance: 10%; Case/Package: 0805
D24 = MMBZ10VAL: TVS Diode (Uni-directional); Manufacturer_Name: Nexperia; Datasheet Link: https://componentsearchengine.com/Datasheets/2/MMBZ10VAL.pdf; Height: 1.1mm; Manufacturer_Part_Number: MMBZ10VAL; Mouser Part Number: N/A; Mouser Price/Stock: https://www.mouser.co.uk/ProductDetail/Nexperia/MMBZ10VAL?qs=vHuUswq2%252Bsyln3ntzeiFlQ%3D%3D
J25 = 502352-0200: Connector; Manufacturer_Name: Molex; Datasheet Link: https://www.molex.com/pdm_docs/sd/5023520200_sd.pdf; Manufacturer_Part_Number: 502352-0200; Mouser Part Number: 538-502352-0200; Mouser Price/Stock: https://www.mouser.co.uk/ProductDetail/Molex/502352-0200?qs=cPOO8qjhL6OPJnOOkJoW%252Bw%3D%3D; Arrow Part Number: 502352-0200; Arrow Price/Stock: https://www.arrow.com/en/products/5023520200/molex?region=europe
R95-R99 R110 R111 = CMP-009-00010-5: as R1 on sheet RFR24 AMS Design - LTC6813 V1; Tolerance: 1%; RoHS Compliant: True; Mounting Technology: SM; Pins: 2; Case/Package: 0805; Max Operating Temperature: 155°C; Min Operating Temperature: -55°C
T3 = CMP-07264-000001-1: as T1 on sheet RFR24 AMS Design - LTC6813 V1; Height: 5.72mm; Automotive: Yes; Package: 0; Device Class L3: unset; ComponentLink2Description: Datasheet; Category: Trans; ComponentLink2URL: https://www.bourns.com/docs/product-datasheets/SM91502AL.pdf; Device Class L1: Passive Components; Manufacturer Part Number: SM91502ALE; Temperature Range High: +125°C; Digikey Description: BMS XFORMER 1-CH 1000V AECQ +125; RoHS: TRUE; Lead Free: Yes; Octopart: https://octopart.com/sm91502ale-bourns-95732123; Device Class L2: Transformers; Temperature: -40°C to +125°C; Temperature Range Low: -40°C
U2 = CMP-09093-000139-1: IC INTERFACE SPECIALIZED 16MSOP

## Sheet RFR24 AMS Design - Microcontroller V1.SchDoc
size A; SheetNumber: 4; SheetTotal: 10
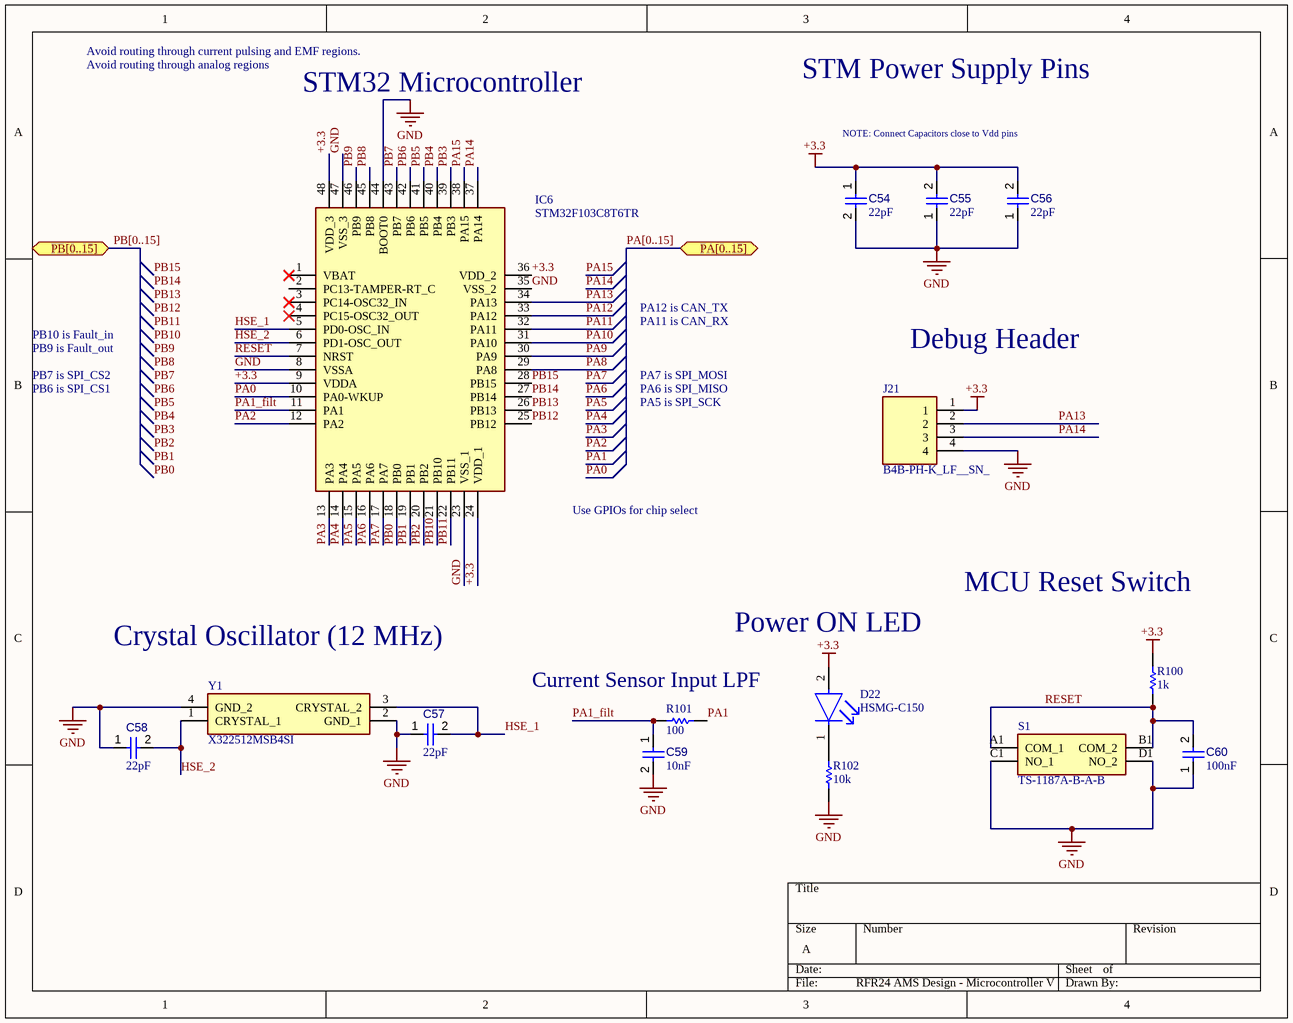
[diagram p3: RFR24 AMS Design - Microcontroller V1.SchDoc]

### Parts
C54  value 22pF  [CAPC2013X145X50LL20T25]  (hidden comment: Capacitor 1 uF +/- 10% 25 V 0805)
C55  value 22pF  [CAPC2013X145X50LL20T25]  (hidden comment: Capacitor 1 uF +/- 10% 25 V 0805)
C56  value 22pF  [CAPC2013X145X50LL20T25]  (hidden comment: Capacitor 1 uF +/- 10% 25 V 0805)
C57  value 22pF  [CAPC2013X145X50LL20T25]  (hidden comment: Capacitor 1 uF +/- 10% 25 V 0805)
C58  value 22pF  [CAPC2013X145X50LL20T25]  (hidden comment: Capacitor 1 uF +/- 10% 25 V 0805)
C59  value 10nF  [CAPC2013X145X50LL20T25]  (hidden comment: Capacitor 1 uF +/- 10% 25 V 0805)
C60  value 100nF  [CAPC2013X145X50LL20T25]  (hidden comment: Capacitor 1 uF +/- 10% 25 V 0805)
D22  HSMG-C150  [FP-HSMG-C150-MFG]
IC6  STM32F103C8T6TR  [QFP50P900X900X160-48N]
J21  B4B-PH-K_LF__SN_  [SHDR4W50P0X200_1X4_990X450X600P]
R100  value 1k  [RESC2013X70X40LL20T20]  (hidden comment: Resistor 1k +/-1% 0805 125 mW)
R101  value 100  [RESC2013X70X40LL20T20]  (hidden comment: Resistor 1k +/-1% 0805 125 mW)
R102  value 10k  [RESC2013X70X40LL20T20]  (hidden comment: Resistor 1k +/-1% 0805 125 mW)
S1  TS-1187A-B-A-B  [TS1187ABAB]
Y1  X322512MSB4SI  [X322512MSB4SI]

### Ports
PA[0..15] (bidir), PB[0..15] (bidir)

### Nets
+3.3: C54.1 C55.2 C56.2 D22.2(A) IC6.9(VDDA) IC6.24(VDD_1) IC6.36(VDD_2) IC6.48(VDD_3) J21.1 R100.2
GND: C54.2 C55.1 C56.1 C57.1 C58.1 C59.2 C60.1 IC6.8(VSSA) IC6.23(VSS_1) IC6.35(VSS_2) IC6.44(BOOT0) IC6.47(VSS_3) J21.4 R102.1 S1.C1(NO_1) S1.D1(NO_2) Y1.2(GND_1) Y1.4(GND_2)
HSE_1: C57.2 IC6.5(PD0-OSC_IN) Y1.3(CRYSTAL_2)
HSE_2: C58.2 IC6.6(PD1-OSC_OUT) Y1.1(CRYSTAL_1)
PA0: IC6.10(PA0-WKUP)
PA1: R101.1
PA1_filt: C59.1 IC6.11(PA1) R101.2
PA2: IC6.12(PA2)
PA3: IC6.13(PA3)
PA4: IC6.14(PA4)
PA5: IC6.15(PA5)
PA6: IC6.16(PA6)  [project net MISO]
PA7: IC6.17(PA7)  [project net MOSI]
PA8: IC6.29(PA8)
PA9: IC6.30(PA9)
PA10: IC6.31(PA10)
PA11: IC6.32(PA11)
PA12: IC6.33(PA12)
PA13: IC6.34(PA13) J21.2
PA14: IC6.37(PA14) J21.3
PA15: IC6.38(PA15)
PB0: IC6.18(PB0)
PB1: IC6.19(PB1)
PB2: IC6.20(PB2)
PB3: IC6.39(PB3)
PB4: IC6.40(PB4)
PB5: IC6.41(PB5)
PB6: IC6.42(PB6)  [project net CS1_L]
PB7: IC6.43(PB7)  [project net CS2_L]
PB8: IC6.45(PB8)
PB9: IC6.46(PB9)
PB10: IC6.21(PB10)
PB11: IC6.22(PB11)
PB12: IC6.25(PB12)
PB13: IC6.26(PB13)
PB14: IC6.27(PB14)
PB15: IC6.28(PB15)
RESET: C60.2 IC6.7(NRST) R100.1 S1.A1(COM_1) S1.B1(COM_2)
NetD22_1: D22.1(C) R102.2

Not connected (* = marked no-connect by the designer): IC6 1(VBAT)* 2(PC13-TAMPER-RT_C) 3(PC14-OSC32_IN)* 4(PC15-OSC32_OUT)*

### Buses and harness runs
bus PA[0..15] = port PA[0..15]
bus PB[0..15] = port PB[0..15]

### Notes on the sheet
- Avoid routing through current pulsing and EMF regions.
- Avoid routing through analog regions
- STM32 Microcontroller
- STM Power Supply Pins
- NOTE: Connect Capacitors close to Vdd pins
- PB9 is Fault_out
- PB10 is Fault_in
- PA12 is CAN_TX
- PA11 is CAN_RX
- Debug Header
- PB6 is SPI_CS1
- PB7 is SPI_CS2
- PA5 is SPI_SCK
- PA6 is SPI_MISO
- PA7 is SPI_MOSI
- Use GPIOs for chip select
- Power ON LED
- MCU Reset Switch
- Crystal Oscillator (12 MHz)
- Current Sensor Input LPF
- Labels drawn without touching a wire or pin: PB0, PB1, PB2, PB3, PB4, PB5, PB6, PB7, PB8, PB9, PB10, PB11, PB12, PB13, PB14, PB15

### Library data of the parts
C54-C60 = CMP-001-00010-6: as C1 on sheet RFR24 AMS Design - LTC6813 V1; RoHS Compliant: True; Pins: 2; Mounting Technology: SM; Max Operating Temperature: 125°C; Min Operating Temperature: -55°C; Tolerance: 10%; Case/Package: 0805
D22 = CMP-2000-05061-2: LED GREEN DIFFUSED 1206 SMD; Manufacturer: Broadcom; Led Orientation: Top View; Max Junction Temp: +95°C; Peak Emmision Wavelength: 570nm; Viewing Angle: 170°; Wavelength: 572nm; Reverse Voltage: 5V; Luminous Intensity: 15mcd; Forward Voltage: 2.2V; Power Dissipation: 65mW; Forward Current: 20mA; ComponentLink2Description: Datasheet; Lead Free: Yes; Temperature Range Low: -40°C; Package: HSMG-C150; Digikey Description: LED GREEN DIFFUSED 1206 SMD; Mouser Description: LED Uni-Color Green 570nm 2-Pin Chip LED T/R; Manufacturer Part Number: HSMG-C150; Temperature Range High: +85°C; Device Class L1: Optoelectronics; Colour: Green; Category: Diode; Device Class L3: unset; RoHS: TRUE; Height: 1.2mm; ComponentLink2URL: https://docs.broadcom.com/docs/AV02-0551EN; Device Class L2: LEDs; Automotive: No; Ipc Land Pattern Name: DIOCP320160X55; Octopart: https://octopart.com/hsmg-c150-broadcom-71131304; Temperature: -40°C to +85°C
IC6 = STM32F103C8T6TR: Integrated Circuit; Manufacturer_Name: STMicroelectronics; Datasheet Link: http://media.digikey.com/pdf/Data%20Sheets/ST%20Microelectronics%20PDFS/STM32F103x8,B.pdf; Height: 1.6mm; Manufacturer_Part_Number: STM32F103C8T6TR; Mouser Part Number: 511-STM32F103C8T6TR; Mouser Price/Stock: https://www.mouser.co.uk/ProductDetail/STMicroelectronics/STM32F103C8T6TR?qs=5HwTSiuA5HDxFj62n06yag%3D%3D; Arrow Part Number: STM32F103C8T6TR; Arrow Price/Stock: https://www.arrow.com/en/products/stm32f103c8t6tr/stmicroelectronics?region=europe
J21 = B4B-PH-K_LF__SN_: Connector; Manufacturer_Name: JST (JAPAN SOLDERLESS TERMINALS); Manufacturer_Part_Number: B4B-PH-K(LF)(SN); Datasheet Link: http://www.jst-mfg.com/product/pdf/eng/ePH.pdf; Height: 6mm
R100-R102 = CMP-009-00010-5: as R1 on sheet RFR24 AMS Design - LTC6813 V1; Tolerance: 1%; RoHS Compliant: True; Mounting Technology: SM; Pins: 2; Case/Package: 0805; Max Operating Temperature: 155°C; Min Operating Temperature: -55°C
S1 = TS-1187A-B-A-B: Switch; Manufacturer_Name: XKB Connectivity; Datasheet Link: http://www.helloxkb.com/public/images/pdf/TS-1187A-X-X-X.pdf; Height: 4.05mm; Manufacturer_Part_Number: TS-1187A-B-A-B
Y1 = X322512MSB4SI: Crystal or Oscillator; Manufacturer_Name: Yangxing Tech; Datasheet Link: https://datasheet.lcsc.com/szlcsc/Yangxing-Tech-X322512MSB4SI_C9002.pdf; Height: 0.8mm; Manufacturer_Part_Number: X322512MSB4SI